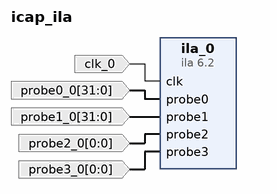
[diagram p0: block diagram of the top level]
# Vivado block design icap_ila, xc7z020clg400-1, Vivado 2020.1
create_bd_design icap_ila

create_bd_port -dir I -type clk clk_0
create_bd_port -dir I -from 31 -to 0 probe0_0
create_bd_port -dir I -from 31 -to 0 probe1_0
create_bd_port -dir I -from 0 -to 0 probe2_0
create_bd_port -dir I -from 0 -to 0 probe3_0

create_bd_cell -type ip -vlnv xilinx.com:ip:ila:6.2 ila_0
set_property -dict [list \
  CONFIG.C_ENABLE_ILA_AXI_MON false \
  CONFIG.C_MONITOR_TYPE Native \
  CONFIG.C_NUM_OF_PROBES 4 \
  CONFIG.C_PROBE0_WIDTH 32 \
  CONFIG.C_PROBE1_WIDTH 32 \
] [get_bd_cells ila_0]

# ---- connections ----

connect_bd_net -net clk_0_1 [get_bd_ports clk_0] [get_bd_pins ila_0/clk]
connect_bd_net -net probe0_0_1 [get_bd_ports probe0_0] [get_bd_pins ila_0/probe0]
connect_bd_net -net probe1_0_1 [get_bd_ports probe1_0] [get_bd_pins ila_0/probe1]
connect_bd_net -net probe2_0_1 [get_bd_ports probe2_0] [get_bd_pins ila_0/probe2]
connect_bd_net -net probe3_0_1 [get_bd_ports probe3_0] [get_bd_pins ila_0/probe3]

validate_bd_design
save_bd_design
